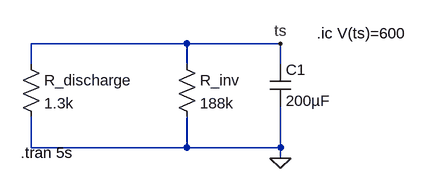
[diagram p0: schematic discharge.asc]
discharge.asc, the LTspice schematic file:
Version 4
SHEET 1 880 680
WIRE 144 96 -96 96
WIRE 288 96 144 96
WIRE -96 128 -96 96
WIRE 144 128 144 96
WIRE 288 128 288 96
WIRE -96 256 -96 208
WIRE 144 256 144 208
WIRE 144 256 -96 256
WIRE 288 256 288 192
WIRE 288 256 144 256
WIRE 288 272 288 256
FLAG 288 96 ts
FLAG 288 272 0
SYMBOL res 128 112 R0
SYMATTR InstName R_inv
SYMATTR Value 188k
SYMBOL res -112 112 R0
SYMATTR InstName R_discharge
SYMATTR Value 1.3k
SYMBOL cap 272 128 R0
SYMATTR InstName C1
SYMATTR Value 200µF
TEXT -112 264 Left 2 !.tran 5s
TEXT 344 80 Left 2 !.ic V(ts)=600

The netlist it stands for:
* discharge.asc
R_inv ts 0 188k
R_discharge ts 0 1.3k
C1 ts 0 200µF
.tran 5s
.ic V(ts)=600
.backanno
.end

* Results of the author's LTspice run, read from the files saved beside the schematic
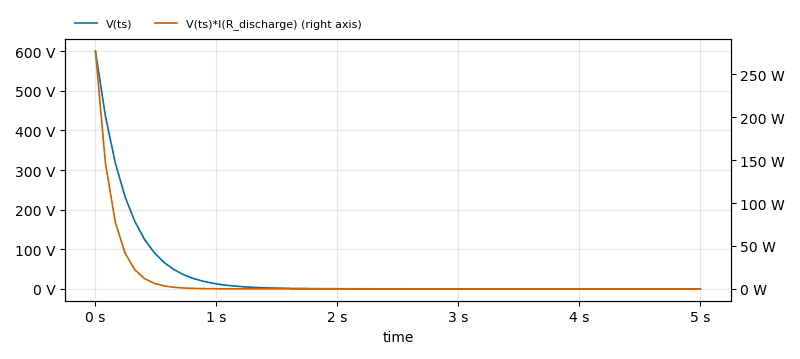
[diagram p1: Transient Analysis of discharge.asc, plotted from the saved traces]
* Transient Analysis, 1 run:
*   V(ts): min 0 V, max 600 V, average 31.24 V, rms 98.01 V, last 0 V
*   V(ts)*I(R_discharge): min 0 W, max 276.9 W, average 7.389 W, rms 33.47 W, last 0 W